# EAGLE design Project_Milestone04 (EAGLE 9.2.0)
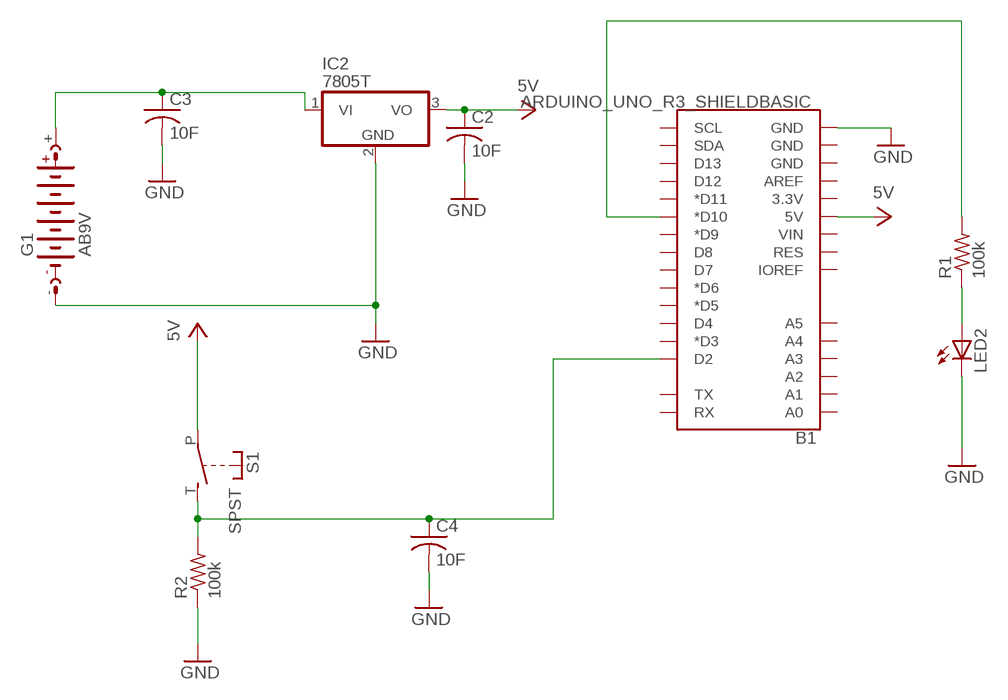
[diagram p0: schematic, sheet 1]

## Parts
B1  ARDUINO_UNO_R3_SHIELDBASIC  [UNO_R3_SHIELD]
C2  10F  C-USC0805  [C0805]
C3  10F  C-USC0805  [C0805]
C4  10F  C-USC0805  [C0805]
G1  AB9V  [AB9V]
IC2  7805T  [TO220H]
LED2  LED5MM  [LED5MM]
R1  100k  R-US_0207/10  [0207/10]
R2  100k  R-US_0207/10  [0207/10]
S1  SPST  [JUDCOSPST]

## Nets
GND: B1.GND@0(GND) C2.2 C3.2 C4.2 G1.- IC2.2(GND) LED2.K(C) R2.1
N$1: C3.1 G1.+ IC2.1(VI)
N$2: B1.D10(*D10) R1.2
N$4: LED2.A R1.1
N$7: B1.D2 C4.1 R2.2 S1.T(S)
VCC: B1.5V C2.1 IC2.3(VO) S1.P ; supply symbol labelled 5V
Unconnected: B1.3.3V B1.A0 B1.A1 B1.A2 B1.A3 B1.A4 B1.A5 B1.AREF B1.D3(*D3) B1.D4 B1.D5(*D5) B1.D6(*D6) B1.D7 B1.D8 B1.D9(*D9) B1.D11(*D11) B1.D12 B1.D13 B1.GND@1(GND) B1.GND@2(GND) B1.IOREF B1.RES B1.RX B1.SCL B1.SDA B1.TX B1.VIN

## Library data of the parts
B1 = SparkFun-Boards:ARDUINO_UNO_R3_SHIELD: Arduino R3 Shield Footprint Shield form compatible with the Arduino Uno R3. SparkFun Products: MG2639 Cellular Shield <https://www.sparkfun.com/products/13120> MIDI Shield <https://www.sparkfun.com/products/12898> R3 Stackable Headers Kit <https://www.sparkfun.com/products/11417>
C2-C4 = adafruit:C-US: CAPACITOR, American symbol
G1 = battery:AB9V: 9-V BATTERY CLIP
IC2 = adafruit:78*: Positive VOLTAGE REGULATOR Added bigger pads to the TO-92 package
LED2 = adafruit:LED: LED OSRAM: - CHIPLED LG R971, LG N971, LY N971, LG Q971, LY Q971, LO R971, LY R971 LH N974, LH R974 LS Q976, LO Q976, LY Q976 LO Q996 - Hyper CHIPLED LW Q18S LB Q993, LB Q99A, LB R99A - SideLED LS A670, LO A670, LY A670, LG A670, LP A670 LB A673, LV A673, LT A673, LW A673 LH A674 LY A675 LS A676, LA A676, LO A676, LY A676, LW A676 LS A679, LY A679, LG A679 - Hyper Micro SIDELED® LS Y876, LA Y876, LO Y876, LY Y876 LT Y87S - SmartLED LW L88C, LW L88S LB L89C, LB L89S, LG L890 LS L89K, LO L89K, LY L89K LS L896, LA L896, LO L896, LY L896 - TOPLED LS T670, LO T670, LY T670, LG T670, LP T670 LSG T670, LSP T670, LSY T670, LOP T670, LYG T670 LG T671, LOG T671, LSG T671 LB T673, LV T673, LT T673, LW T673 LH T674 LS T676, LA T676, LO T676, LY T676, LB T676, LH T676, LSB T676, LW T676 LB T67C, LV T67C, LT T67C, LS T67K, LO T67K, LY T67K, LW E67C LS E67B, LA E67B, LO E67B, LY E67B, LB E67C, LV E67C, LT E67C LW T67C LS T679, LY T679, LG T679 LS T770, LO T770, LY T770, LG T770, LP T770 LB T773, LV T773, LT T773, LW T773 LH T774 LS E675, LA E675, LY E675, LS T675 LS T776, LA T776, LO T776, LY T776, LB T776 LHGB T686 LT T68C, LB T68C - Hyper Mini TOPLED® LB M676 - Mini TOPLED Santana® LG M470 LS M47K, LO M47K, LY M47K Source: http://www.osram.convergy.de/
R1 R2 = rcl:R-US_: RESISTOR, American symbol; SPICEPREFIX: R
S1 = adafruit:SPST: Judco 50-0015-00

## Board
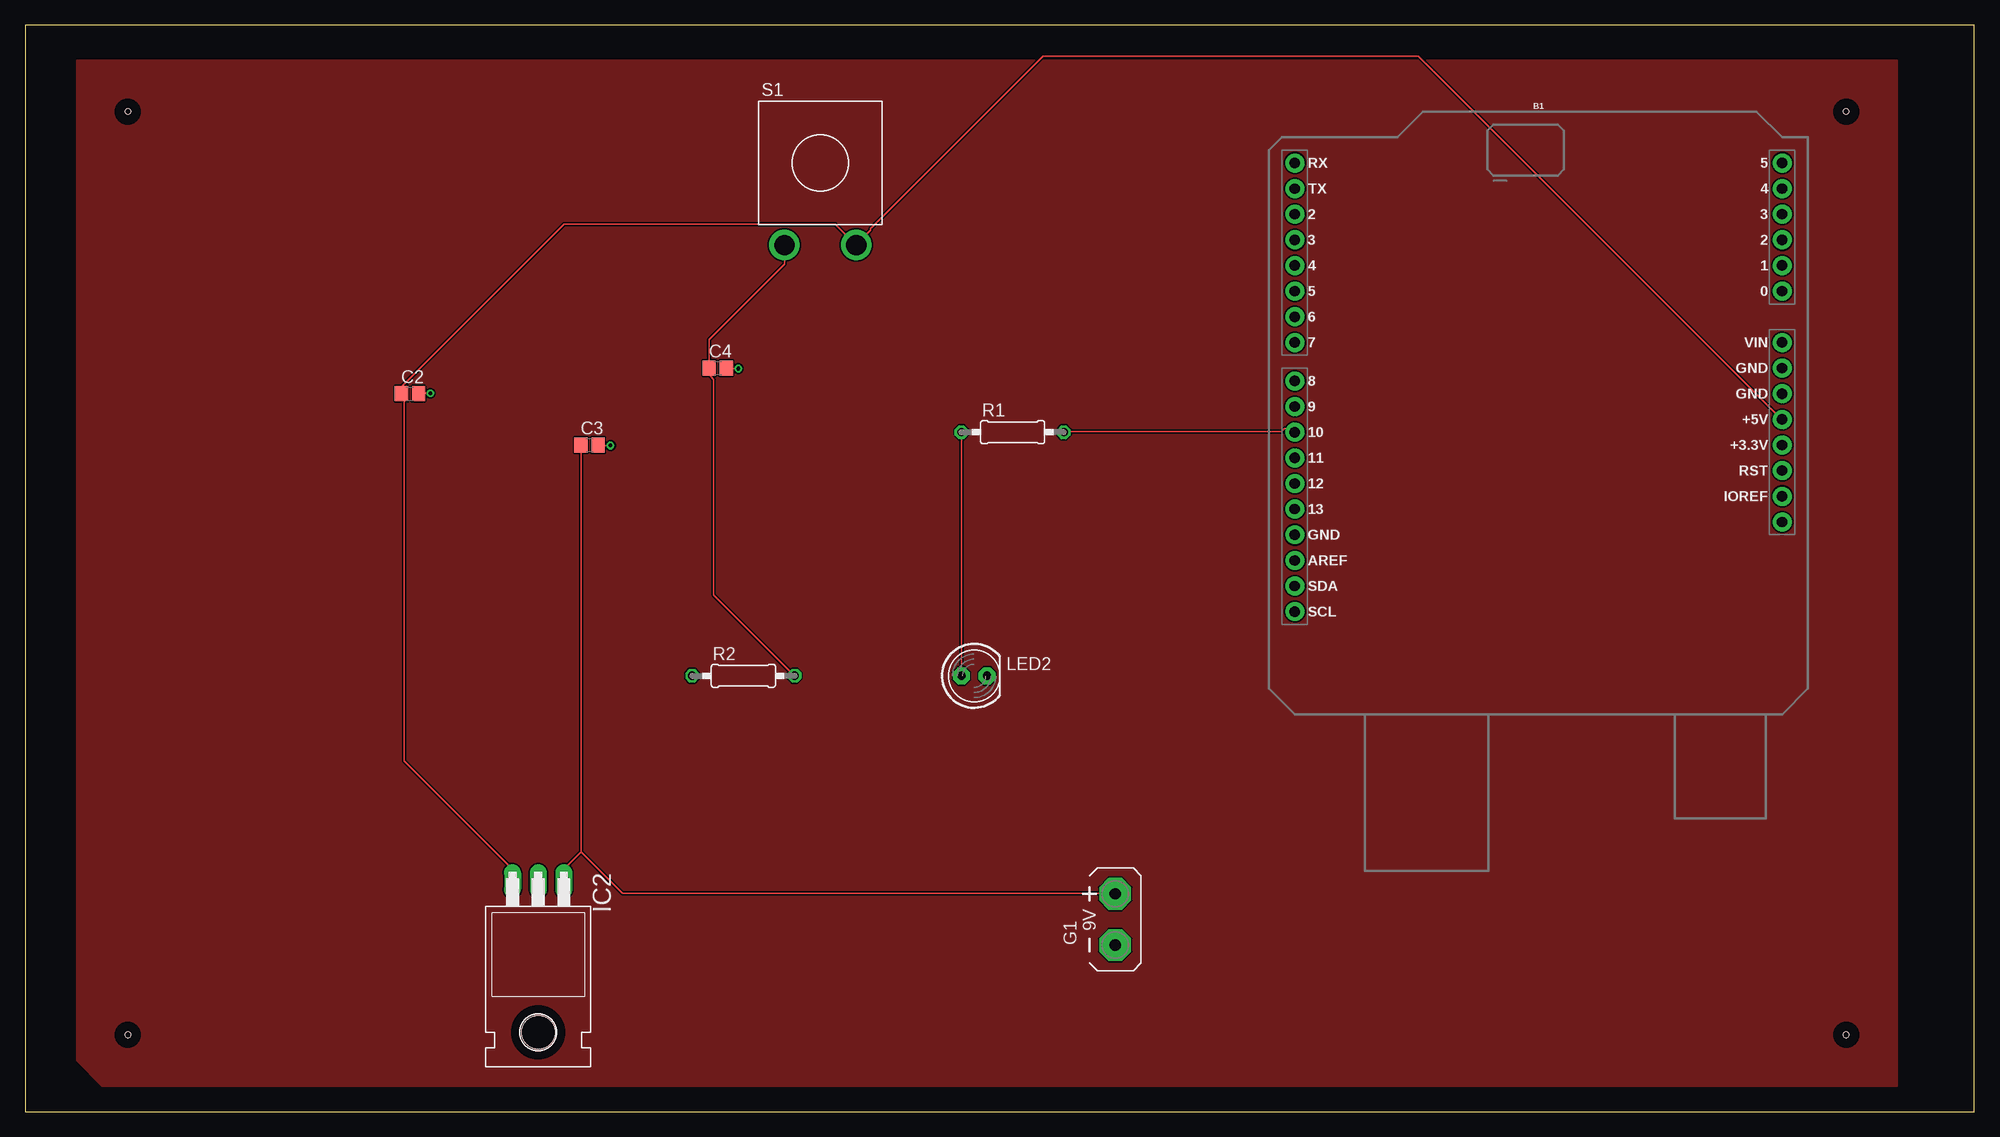
[diagram p1: board, top side]
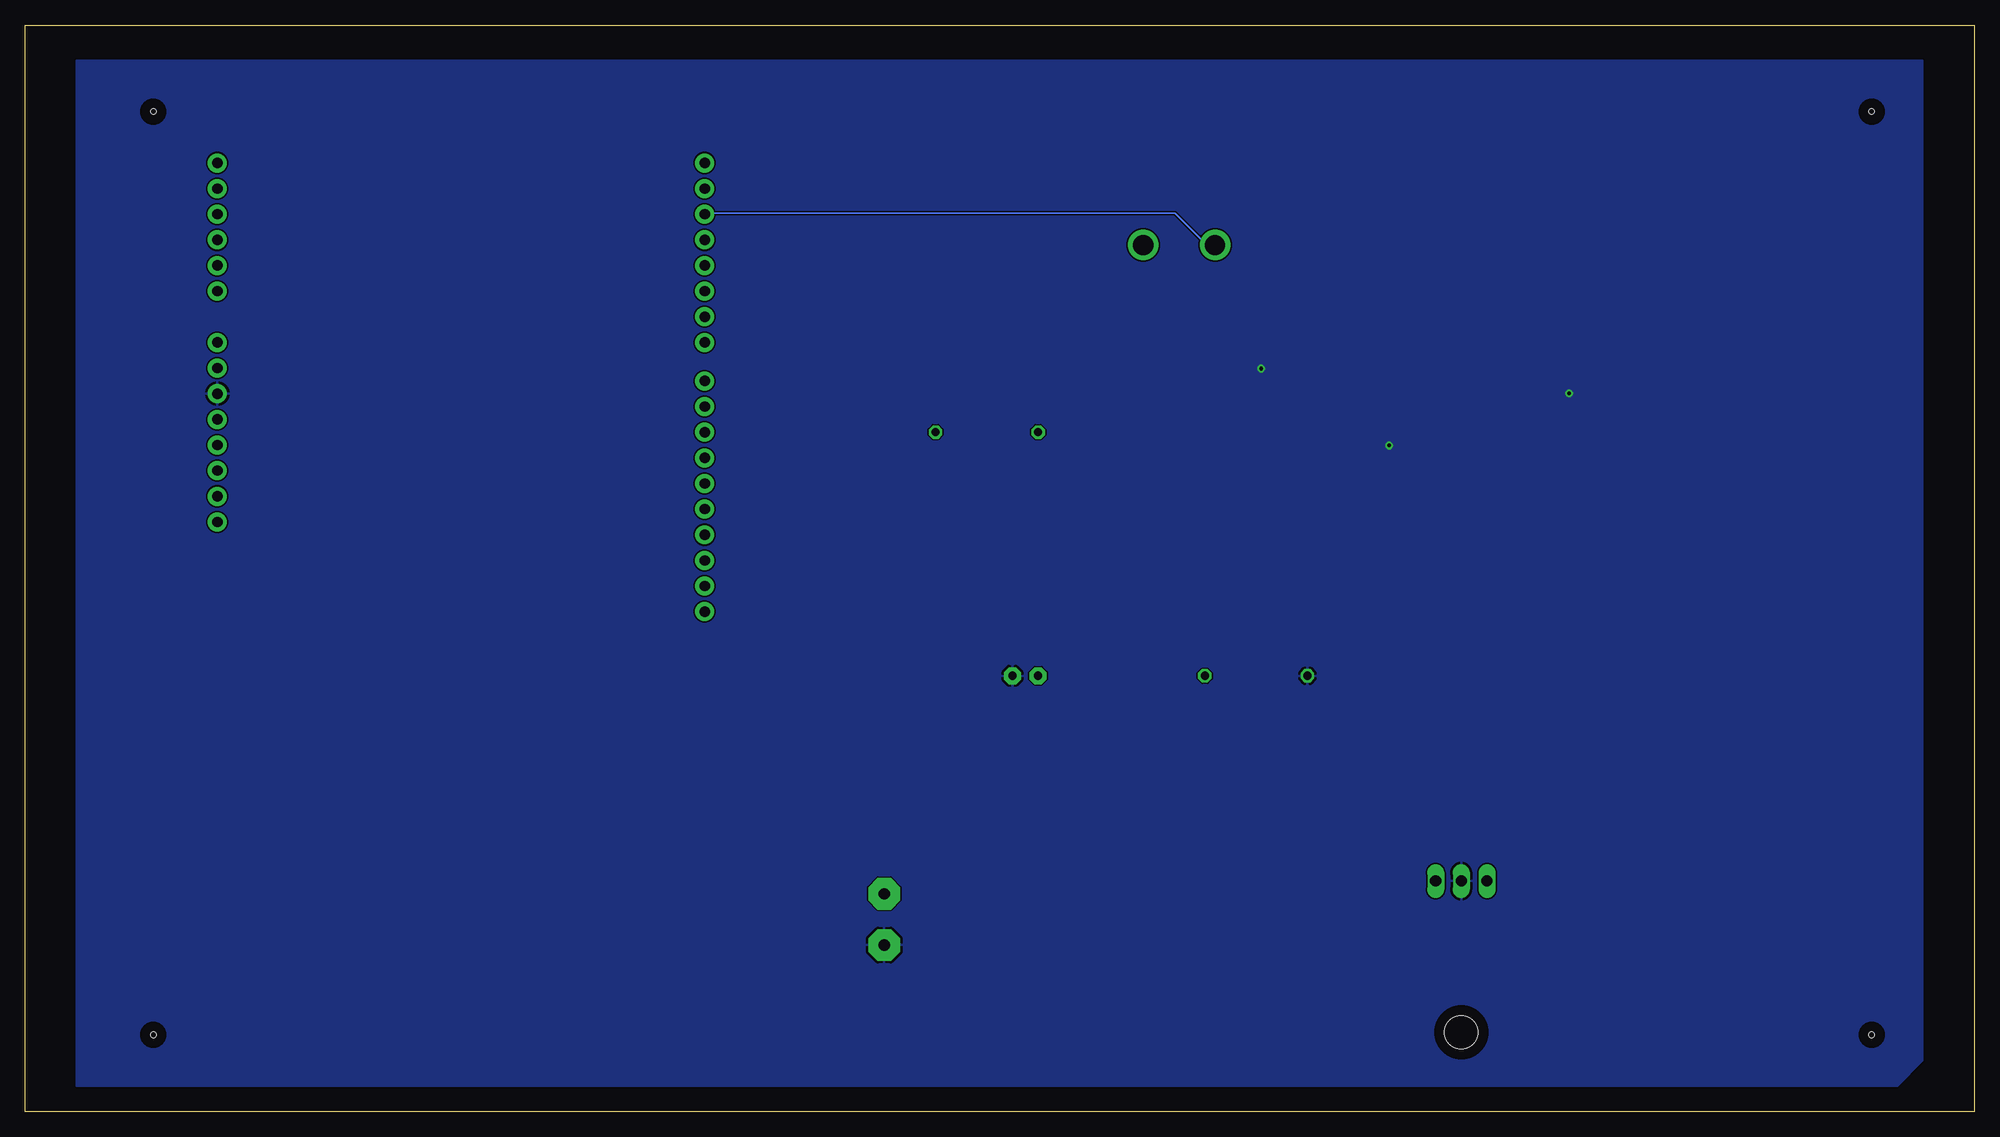
[diagram p2: board, bottom side, seen from below]

Size 193.02 x 107.62 mm. Coordinates in mm from the lower left corner, seen from the top.
Outline: 0,0 193.02,0 193.02,107.62 0,107.62 0,0
Copper layers (1*16): Top 0.035mm / dielectric 1.5mm / Bottom 0.035mm
Design rules "default": minimum track width 6mil, minimum drill 0.35mm, track to track 6mil, track to pad 6mil, pad to pad 6mil, via to via 6mil, smd to smd 6mil, copper to edge 40mil, drill to drill 6mil, minimum pad ring 10mil, minimum via ring 8mil, stop-mask expansion 4mil, vias tented up to drill 0mil, thermal gap 10mil
Holes 0.55 mm at 10.16,99.06 10.16,7.62 180.34,7.62 180.34,99.06

### Footprints (pad centres in the part's own frame; a part is rotated, then mirrored left to right if it is on the bottom)
UNO_R3_SHIELD = drill 1.016 pad 1.88: 3.3V 24.13,-2.54; 5V 24.13,0; A0 24.13,12.7; A1 24.13,15.24; A2 24.13,17.78; A3 24.13,20.32; A4 24.13,22.86; A5 24.13,25.4; AREF -24.13,-13.97; D2 -24.13,20.32; D3 -24.13,17.78; D4 -24.13,15.24; D5 -24.13,12.7; D6 -24.13,10.16; D7 -24.13,7.62; D8 -24.13,3.81; D9 -24.13,1.27; D10 -24.13,-1.27; D11 -24.13,-3.81; D12 -24.13,-6.35; D13 -24.13,-8.89; GND@0 24.13,2.54; GND@1 24.13,5.08; GND@2 -24.13,-11.43; IOREF 24.13,-7.62; NC 24.13,-10.16; RES 24.13,-5.08; RX -24.13,25.4; SCL -24.13,-19.05; SDA -24.13,-16.51; TX -24.13,22.86; VIN 24.13,7.62
C0805 = smd 1.3 x 1.5: 1 -0.85,0; 2 0.85,0
AB9V = drill 1.118 pad 3.15 octagon: + 0,2.54; - 0,-2.54
TO220H = drill 1.118 long: 1 -2.54,-10.16; 2 0,-10.16; 3 2.54,-10.16 | hole 3.302: 0,4.826
LED5MM = drill 0.813 pad 1.676 octagon: A -1.27,0; K 1.27,0
0207/10 = drill 0.813 octagon: 1 -5.08,0; 2 5.08,0
JUDCOSPST = drill 2: P 3.556,-8.128; T -3.556,-8.128

### Placement (x,y rotation side)
B1  149.86,68.58 0 top
C2  38.1,71.12 0 top
C3  55.88,66.04 0 top
C4  68.58,73.66 0 top
G1  107.95,19.05 0 top
IC2  50.8,12.7 180 top
LED2  93.98,43.18 0 top
R1  97.79,67.31 0 top
R2  71.12,43.18 0 top
S1  78.74,93.98 0 top

### Tracks (layer width: path | path; a pad name or v marks a point on that pad's centre or on a via)
GND  (via drill 0.35)
  Top 0.152: v40.13,71.17 39.06,71.17 C2.2 | v57.96,65.99 56.74,65.99 C3.2 | v70.61,73.61 69.55,73.61 C4.2
  pour Bottom: 5.08,104.14 5.08,5.08 7.62,2.54 187.96,2.54 187.96,104.14
N$1
  Top 0.152: 55.07,25.76 55.07,65.99 C3.1 | 55.07,25.76 53.39,24.08 53.39,22.86 IC2.1 | 55.07,25.76 59.18,21.64 107.95,21.64 G1.+
N$2
  Top 0.152: R1.2 102.92,67.36 124.41,67.36 124.71,67.67 125.32,67.67 125.63,67.36 B1.D10
N$4
  Top 0.152: LED2.A R1.1
N$7
  Top 0.152: S1.T 75.18,83.97 67.72,76.5 67.72,73.76 C4.1 67.87,73.61 67.87,72.85 68.17,72.54 68.17,51.21 R2.2
  Bottom 0.152: B1.D2 125.63,89 79.15,89 76.1,85.95 75.18,85.95 S1.T
TOP
  pour Top: 5.08,104.14 5.08,5.08 7.62,2.54 185.42,2.54 185.42,104.14
VCC
  Top 0.152: IC2.3 48.21,22.86 48.21,24.08 37.54,34.75 37.54,70.87 37.39,71.02 C2.1 37.39,71.17 37.39,71.93 53.39,87.94 80.21,87.94 S1.P 82.35,85.95 83.72,87.33 83.72,87.48 100.79,104.55 137.97,104.55 173.94,68.58 B1.5V